# Altium schematic sheet OXCO_DaughterCard_Main.schdoc: NOT USED
size C; Date: NOT USED; ApprovedBy: NOT USED; CheckedBy: NOT USED; Author: NOT USED; CompanyName: NOT USED; DrawnBy: NOT USED; Engineer: NOT USED; Organization: NOT USED; Address1: NOT USED; Address2: NOT USED; Address3: NOT USED; Address4: NOT USED; DocumentNumber: Use Project Parameter prjSchematic_IPN; Revision: NOT USED; SheetNumber: 1; SheetTotal: 1; sch_PageDescription: DaughterCard with 4 swappable OCXO's; PageDate: NOT USED; Time: NOT USED; DocumentFullPathAndName: NOT USED; DocumentName: NOT USED; ImagePath: NOT USED; ProjectName: NOT USED; Application_BuildNumber: NOT USED
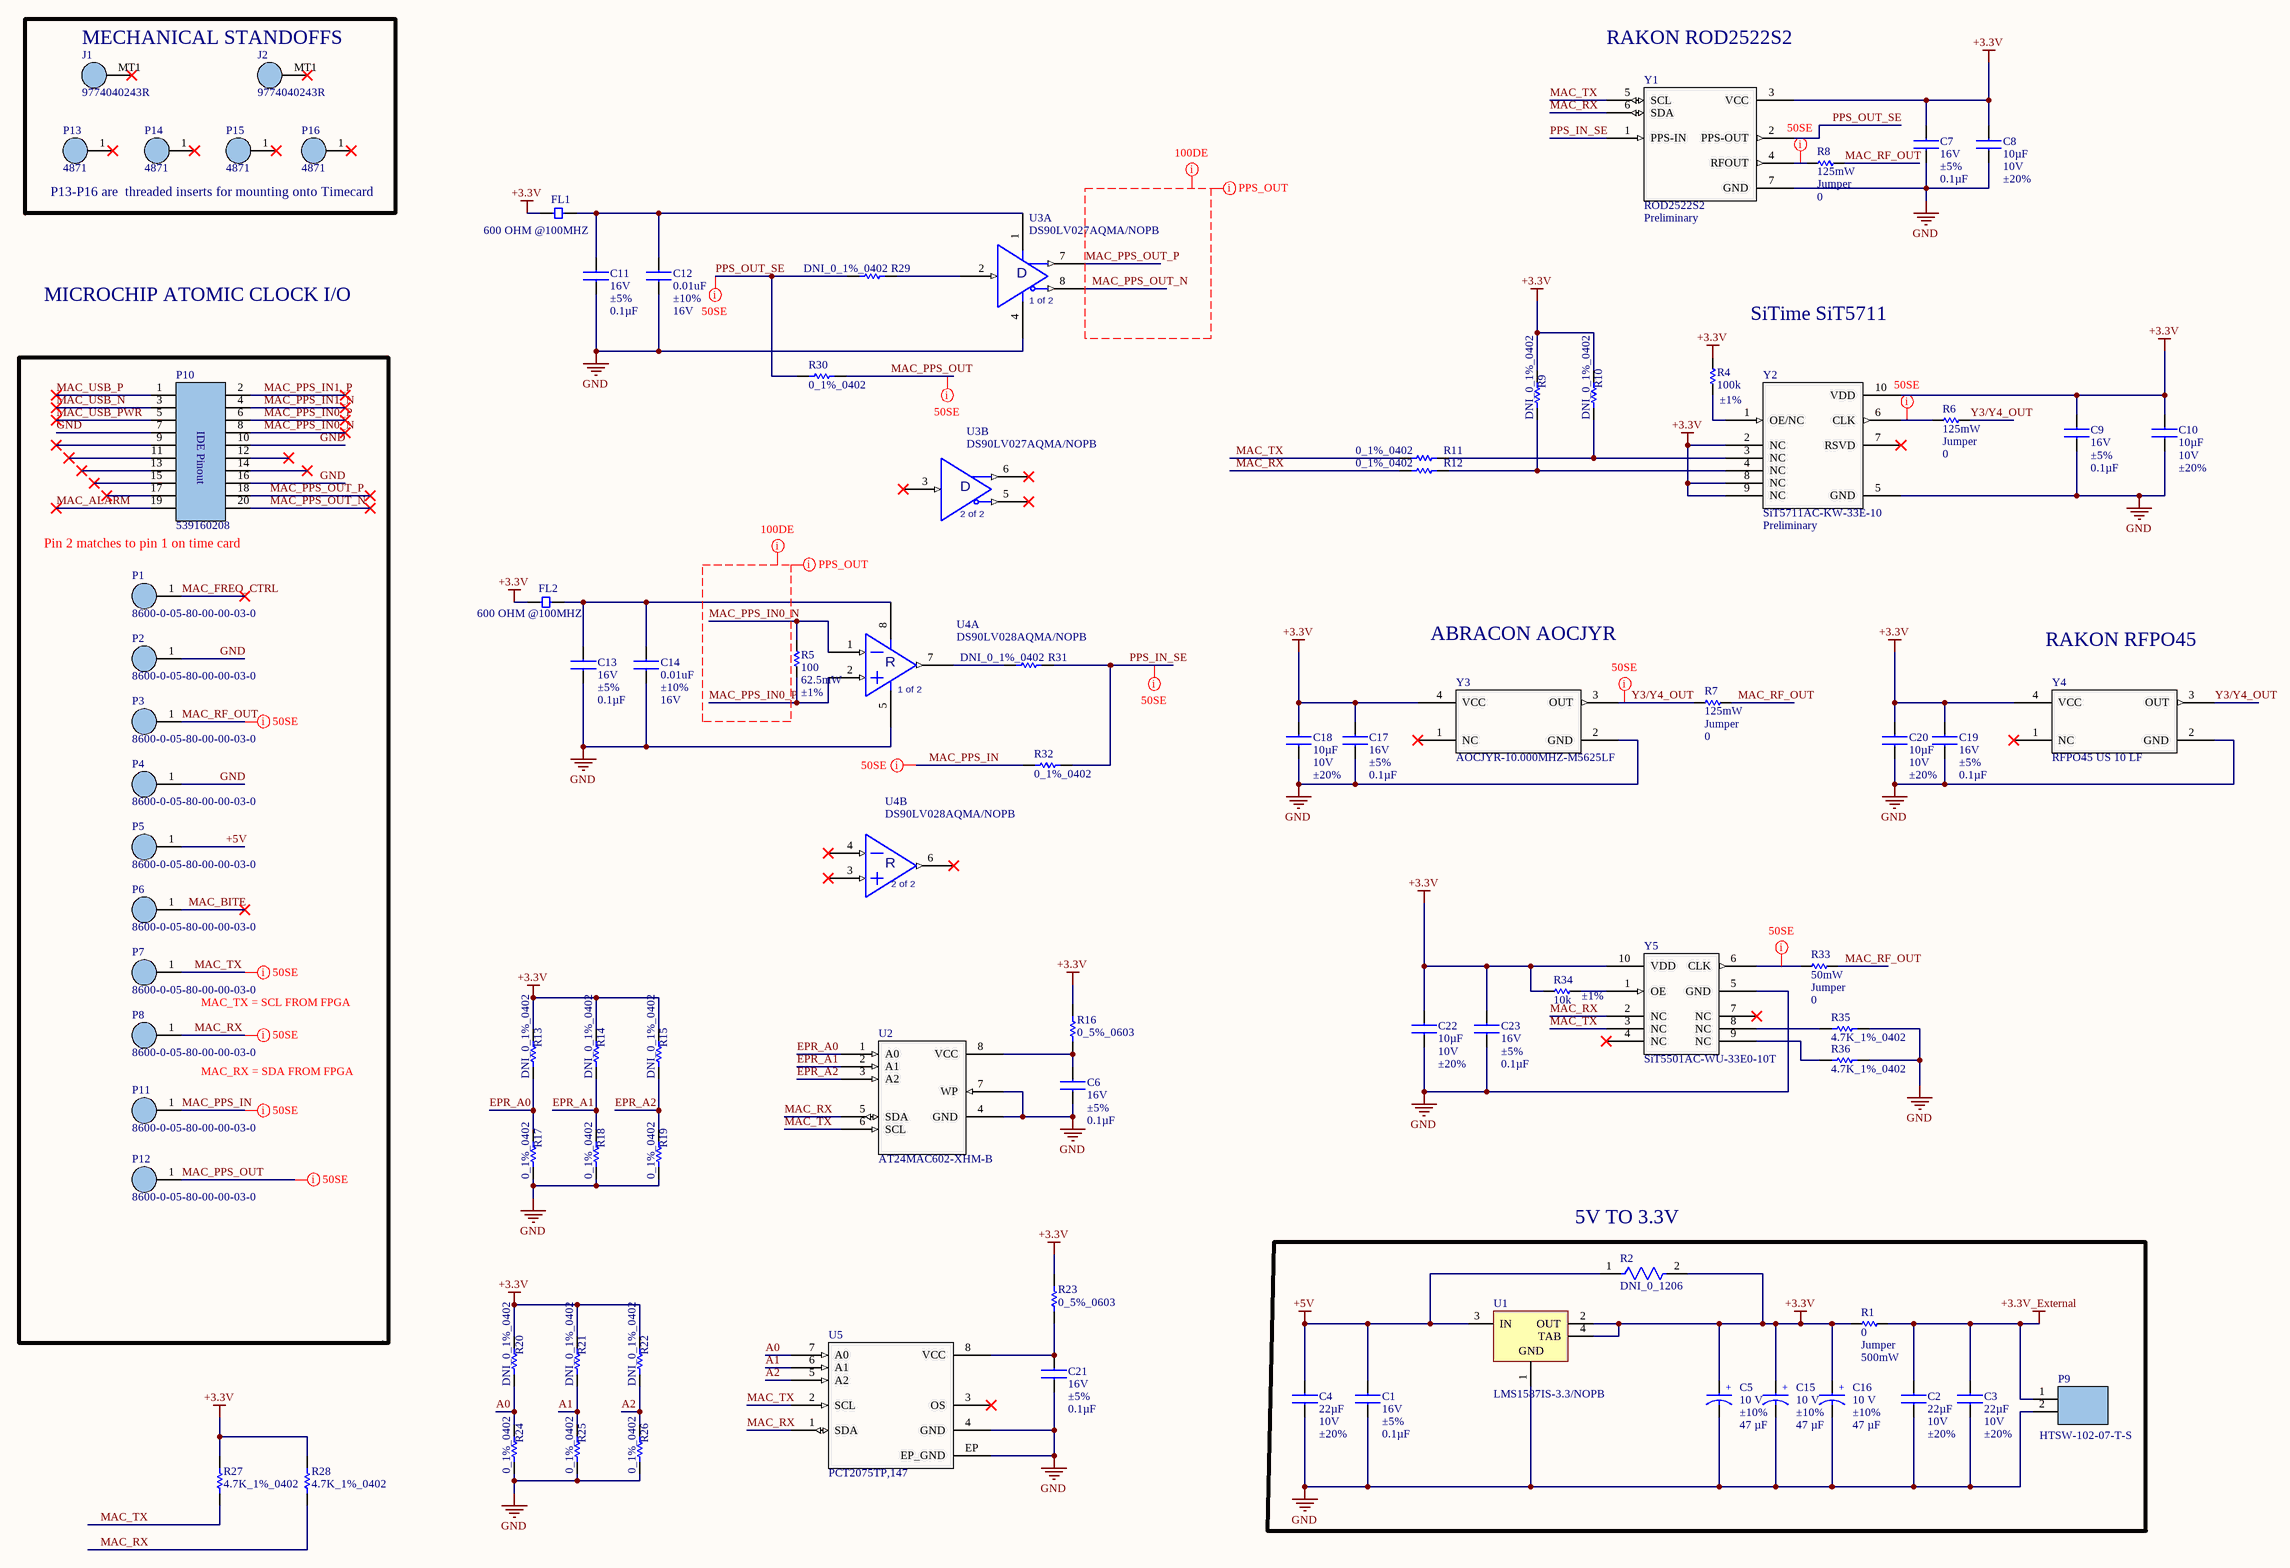
[diagram p0: OXCO_DaughterCard_Main.schdoc]

## Parts
C1  Voltage Rating: 16V  Tolerance: ±5%  Capacitance: 0.1µF  [CAPC1005X055N]  (hidden comment: Samsung Electro-Mechanics_CL05B104JO5NNNC)
C2  Capacitance: 22µF  Voltage Rating: 10V  Tolerance: ±20%  [CAPC2013X140N]  (hidden comment: Murata_GRM21BR61A226ME51L)
C3  Capacitance: 22µF  Voltage Rating: 10V  Tolerance: ±20%  [CAPC2013X140N]  (hidden comment: Murata_GRM21BR61A226ME51L)
C4  Capacitance: 22µF  Voltage Rating: 10V  Tolerance: ±20%  [CAPC2013X140N]  (hidden comment: Murata_GRM21BR61A226ME51L)
C5  Voltage Rating: 10 V  Tolerance: ±10%  Capacitance: 47 µF  [CAPMP3528X210N_T520]  (hidden comment: Kemet_T491B476K010AT)
C6  Voltage Rating: 16V  Tolerance: ±5%  Capacitance: 0.1µF  [CAPC1005X055N]  (hidden comment: Samsung Electro-Mechanics_CL05B104JO5NNNC)
C7  Voltage Rating: 16V  Tolerance: ±5%  Capacitance: 0.1µF  [CAPC1005X055N]  (hidden comment: Samsung Electro-Mechanics_CL05B104JO5NNNC)
C8  Capacitance: 10µF  Voltage Rating: 10V  Tolerance: ±20%  [CAPC1608X100N]  (hidden comment: Murata_GRM188D71A106MA73D)
C9  Voltage Rating: 16V  Tolerance: ±5%  Capacitance: 0.1µF  [CAPC1005X055N]  (hidden comment: Samsung Electro-Mechanics_CL05B104JO5NNNC)
C10  Capacitance: 10µF  Voltage Rating: 10V  Tolerance: ±20%  [CAPC1608X100N]  (hidden comment: Murata_GRM188D71A106MA73D)
C11  Voltage Rating: 16V  Tolerance: ±5%  Capacitance: 0.1µF  [CAPC1005X055N]  (hidden comment: Samsung Electro-Mechanics_CL05B104JO5NNNC)
C12  Capacitance: 0.01uF  Tolerance: ±10%  Voltage Rating: 16V  [CAPC1005X055N]  (hidden comment: Yageo_CC0402KRX7R7BB103)
C13  Voltage Rating: 16V  Tolerance: ±5%  Capacitance: 0.1µF  [CAPC1005X055N]  (hidden comment: Samsung Electro-Mechanics_CL05B104JO5NNNC)
C14  Capacitance: 0.01uF  Tolerance: ±10%  Voltage Rating: 16V  [CAPC1005X055N]  (hidden comment: Yageo_CC0402KRX7R7BB103)
C15  Voltage Rating: 10 V  Tolerance: ±10%  Capacitance: 47 µF  [CAPMP3528X210N_T520]  (hidden comment: Kemet_T491B476K010AT)
C16  Voltage Rating: 10 V  Tolerance: ±10%  Capacitance: 47 µF  [CAPMP3528X210N_T520]  (hidden comment: Kemet_T491B476K010AT)
C17  Voltage Rating: 16V  Tolerance: ±5%  Capacitance: 0.1µF  [CAPC1005X055N]  (hidden comment: Samsung Electro-Mechanics_CL05B104JO5NNNC)
C18  Capacitance: 10µF  Voltage Rating: 10V  Tolerance: ±20%  [CAPC1608X100N]  (hidden comment: Murata_GRM188D71A106MA73D)
C19  Voltage Rating: 16V  Tolerance: ±5%  Capacitance: 0.1µF  [CAPC1005X055N]  (hidden comment: Samsung Electro-Mechanics_CL05B104JO5NNNC)
C20  Capacitance: 10µF  Voltage Rating: 10V  Tolerance: ±20%  [CAPC1608X100N]  (hidden comment: Murata_GRM188D71A106MA73D)
C21  Voltage Rating: 16V  Tolerance: ±5%  Capacitance: 0.1µF  [CAPC1005X055N]  (hidden comment: Samsung Electro-Mechanics_CL05B104JO5NNNC)
C22  Capacitance: 10µF  Voltage Rating: 10V  Tolerance: ±20%  [CAPC1608X090N]  (hidden comment: Murata_GRM188R61A106ME69D)
C23  Voltage Rating: 16V  Tolerance: ±5%  Capacitance: 0.1µF  [CAPC1005X055N]  (hidden comment: Samsung Electro-Mechanics_CL05B104JO5NNNC)
FL1  Impedance @ Frequency: 600 OHM @100MHZ  [INDC1608X095N]  (hidden comment: TDK_MPZ1608S601ATA00)
FL2  Impedance @ Frequency: 600 OHM @100MHZ  [INDC1608X095N]  (hidden comment: TDK_MPZ1608S601ATA00)
J1  Manufacturer Part Number: 9774040243R  [TH000V_300DIAx400_001mt_9774040243R]  (hidden comment: Wurth_9774040243R)
J2  Manufacturer Part Number: 9774040243R  [TH000V_300DIAx400_001mt_9774040243R]  (hidden comment: Wurth_9774040243R)
P1  Manufacturer Part Number: 8600-0-05-80-00-00-03-0  [TH001V_109DIA_000mt_8600-0]  (hidden comment: Mill-Max_8600-0-05-80-00-00-03-0)
P2  Manufacturer Part Number: 8600-0-05-80-00-00-03-0  [TH001V_109DIA_000mt_8600-0]  (hidden comment: Mill-Max_8600-0-05-80-00-00-03-0)
P3  Manufacturer Part Number: 8600-0-05-80-00-00-03-0  [TH001V_109DIA_000mt_8600-0]  (hidden comment: Mill-Max_8600-0-05-80-00-00-03-0)
P4  Manufacturer Part Number: 8600-0-05-80-00-00-03-0  [TH001V_109DIA_000mt_8600-0]  (hidden comment: Mill-Max_8600-0-05-80-00-00-03-0)
P5  Manufacturer Part Number: 8600-0-05-80-00-00-03-0  [TH001V_109DIA_000mt_8600-0]  (hidden comment: Mill-Max_8600-0-05-80-00-00-03-0)
P6  Manufacturer Part Number: 8600-0-05-80-00-00-03-0  [TH001V_109DIA_000mt_8600-0]  (hidden comment: Mill-Max_8600-0-05-80-00-00-03-0)
P7  Manufacturer Part Number: 8600-0-05-80-00-00-03-0  [TH001V_109DIA_000mt_8600-0]  (hidden comment: Mill-Max_8600-0-05-80-00-00-03-0)
P8  Manufacturer Part Number: 8600-0-05-80-00-00-03-0  [TH001V_109DIA_000mt_8600-0]  (hidden comment: Mill-Max_8600-0-05-80-00-00-03-0)
P9  Manufacturer Part Number: HTSW-102-07-T-S  [TH002_254_508x254x838_000mt_HTSW]  (hidden comment: Samtec_HTSW-102-07-T-S)
P10  Manufacturer Part Number: 539160208  [SM020V_50_730x310x337_000mt_53916]  (hidden comment: Molex_539160208)
P11  Manufacturer Part Number: 8600-0-05-80-00-00-03-0  [TH001V_109DIA_000mt_8600-0]  (hidden comment: Mill-Max_8600-0-05-80-00-00-03-0)
P12  Manufacturer Part Number: 8600-0-05-80-00-00-03-0  [TH001V_109DIA_000mt_8600-0]  (hidden comment: Mill-Max_8600-0-05-80-00-00-03-0)
P13  4871  [Keystone_4871]
P14  4871  [Keystone_4871]
P15  4871  [Keystone_4871]
P16  4871  [Keystone_4871]
R1  Resistance: 0  Tolerance: Jumper  Power (Watts): 500mW  [RESC3225X070N]  (hidden comment: Stackpole Electronics, Inc._RMCF1210ZT0R00)
R2  DNI_0_1206  [FP-RC1206-MFG]  (no BOM)
R4  Resistance: 100k  Tolerance: ±1%  [RESC1005X040N]  (hidden comment: Panasonic_ERJ-2RKF1003X)
R5  Resistance: 100  Power (Watts): 62.5mW  Tolerance: ±1%  [RESC1005X040N]  (hidden comment: Yageo_RC0402FR-07100RL)
R6  Power (Watts): 125mW  Tolerance: Jumper  Resistance: 0  [RESC1005X045N]  (hidden comment: Stackpole Electronics, Inc._HCJ0402ZT0R00)
R7  Power (Watts): 125mW  Tolerance: Jumper  Resistance: 0  [RESC1005X045N]  (hidden comment: Stackpole Electronics, Inc._HCJ0402ZT0R00)
R8  Power (Watts): 125mW  Tolerance: Jumper  Resistance: 0  [RESC1005X045N]  (hidden comment: Stackpole Electronics, Inc._HCJ0402ZT0R00)
R9  DNI_0_1%_0402  [RESC1005X40X25NL05T10]  (no BOM)
R10  DNI_0_1%_0402  [RESC1005X40X25NL05T10]  (no BOM)
R11  0_1%_0402  [RESC1005X40X25NL05T10]
R12  0_1%_0402  [RESC1005X40X25NL05T10]
R13  DNI_0_1%_0402  [RESC1005X40X25NL05T10]  (no BOM)
R14  DNI_0_1%_0402  [RESC1005X40X25NL05T10]  (no BOM)
R15  DNI_0_1%_0402  [RESC1005X40X25NL05T10]  (no BOM)
R16  0_5%_0603  [RESC1608X55X25ML10T15]
R17  0_1%_0402  [RESC1005X40X25NL05T10]
R18  0_1%_0402  [RESC1005X40X25NL05T10]
R19  0_1%_0402  [RESC1005X40X25NL05T10]
R20  DNI_0_1%_0402  [RESC1005X40X25NL05T10]  (no BOM)
R21  DNI_0_1%_0402  [RESC1005X40X25NL05T10]  (no BOM)
R22  DNI_0_1%_0402  [RESC1005X40X25NL05T10]  (no BOM)
R23  0_5%_0603  [RESC1608X55X25ML10T15]
R24  0_1%_0402  [RESC1005X40X25NL05T10]
R25  0_1%_0402  [RESC1005X40X25NL05T10]
R26  0_1%_0402  [RESC1005X40X25NL05T10]
R27  4.7K_1%_0402  [RESC1005X40X25LL05T05]
R28  4.7K_1%_0402  [RESC1005X40X25LL05T05]
R29  DNI_0_1%_0402  [RESC1005X40X25NL05T10]  (no BOM)
R30  0_1%_0402  [RESC1005X40X25NL05T10]
R31  DNI_0_1%_0402  [RESC1005X40X25NL05T10]  (no BOM)
R32  0_1%_0402  [RESC1005X40X25NL05T10]
R33  Power (Watts): 50mW  Tolerance: Jumper  Resistance: 0  [RESC0603X026N]  (hidden comment: Yageo_RC0201JR-070RL)
R34  Resistance: 10k  Tolerance: ±1%  [RESC0603X026N]  (hidden comment: Yageo_RC0201FR-0710KL)
R35  4.7K_1%_0402  [RESC1005X40X25LL05T05]
R36  4.7K_1%_0402  [RESC1005X40X25LL05T05]
U1  LMS1587IS-3.3/NOPB  [KTT0003B_L]
U2  Manufacturer Part Number: AT24MAC602-XHM-B  [TSSOP65P640X120-8N]  (hidden comment: Microchip_AT24MAC602-XHM-B)
U3  Manufacturer Part Number: DS90LV027AQMA/NOPB  [SOP127P600X175_8N]  (hidden comment: TI_DS90LV027AQMA/NOPB)  (parts A,B of 2)
U4  Manufacturer Part Number: DS90LV028AQMA/NOPB  [SOP127P600X175_8N]  (hidden comment: TI_DS90LV028AQMA/NOPB)  (parts A,B of 2)
U5  Manufacturer Part Number: PCT2075TP,147  [SON50P300X200X80-HS-9N_EP160x160_IPC]  (hidden comment: NXP_PCT2075TP,147)
Y1  Manufacturer Part Number: ROD2522S2  Part Status: Preliminary  [OSC007_762_2540x2200x1230]  (hidden comment: Rakon_ROD2522S2)  (no BOM)
Y2  Manufacturer Part Number: SiT5711AC-KW-33E-10  Part Status: Preliminary  [SON150P700X619-10N_SiT5711]  (hidden comment: SiTime_SiT5711AC-KW-33E-10)  (no BOM)
Y3  Manufacturer Part Number: AOCJYR-10.000MHZ-M5625LF  [OSC004_600_970x750x410_AOCJYR]  (hidden comment: Abracon_AOCJYR-10.000MHZ-M5625LF)  (no BOM)
Y4  Manufacturer Part Number: RFPO45 US 10 LF  [OSC004_600_970x750x430_RFP045]  (hidden comment: Rakon_RFPO45 US 10 LF)  (no BOM)
Y5  Manufacturer Part Number: SiT5501AC-WU-33E0-10T  [SITIME_SPL-086-CQFN-010-C07050_REV_DRAFT]  (hidden comment: SiTime_SiT5501AC-WU-33E0-10T)  (no BOM)

## Blocks framed on the sheet
MECHANICAL STANDOFFS: J1 J2 P13-P16
Pin 2 matches to pin 1 on time card: P1-P8 P10-P12
5V TO 3.3V: C1-C5 C15 C16 P9 R1 R2 U1

## Nets
+3.3V: C5.1 C7.1 C8.1 C9.1 C10.1 C15.1 C16.1 C17.1 C18.1 C19.1 C20.1 C22.1 C23.1 FL1.1 FL2.1 R1.1 R2.2 R4.1 R9.1 R10.1 R13.1 R14.1 R15.1 R16.2 R20.1 R21.1 R22.1 R23.2 R27.2 R28.2 R34.1 U1.2(OUT) U1.4(TAB) Y1.3(VCC) Y2.2(NC) Y2.8(NC) Y2.9(NC) Y2.10(VDD) Y3.4(VCC) Y4.4(VCC) Y5.10(VDD)
+3.3V_External: C2.1 C3.1 P9.1 R1.2
+5V: C1.1 C4.1 P5.1 R2.1 U1.3(IN)
GND: C1.2 C2.2 C3.2 C4.2 C5.2 C6.2 C7.2 C8.2 C9.2 C10.2 C11.2 C12.2 C13.2 C14.2 C15.2 C16.2 C17.2 C18.2 C19.2 C20.2 C21.2 C22.2 C23.2 P2.1 P4.1 P9.2 P10.7 P10.10 P10.16 R17.2 R18.2 R19.2 R24.2 R25.2 R26.2 R35.1 R36.1 U1.1(GND) U2.4(GND) U2.7(WP) U3.4(GND) U4.5(GND) U5.4(GND) U5.EP(EP_GND) Y1.7(GND) Y2.5(GND) Y3.2(GND) Y4.2(GND) Y5.5(GND)
A0: R20.2 R24.1 U5.7(A0)
A1: R21.2 R25.1 U5.6(A1)
A2: R22.2 R26.1 U5.5(A2)
EPR_A0: R13.2 R17.1 U2.1(A0)
EPR_A1: R14.2 R18.1 U2.2(A1)
EPR_A2: R15.2 R19.1 U2.3(A2)
MAC_ALARM: P10.19
MAC_BITE: P6.1
MAC_FREQ_CTRL: P1.1
MAC_PPS_IN: P11.1 R32.1
MAC_PPS_IN0_N: P10.8 R5.1 U4.1(RIN1-)
MAC_PPS_IN0_P: P10.6 R5.2 U4.2(RIN1+)
MAC_PPS_IN1_N: P10.4
MAC_PPS_IN1_P: P10.2
MAC_PPS_OUT: P12.1 R30.2
MAC_PPS_OUT_N: P10.20 U3.8(DO-1)
MAC_PPS_OUT_P: P10.18 U3.7(DO+1)
MAC_RF_OUT: P3.1 R7.2 R8.2 R33.2
MAC_RX: P8.1 R12.1 R28.1 U2.5(SDA) U5.1(SDA) Y1.6(SDA) Y5.2(NC)
MAC_TX: P7.1 R11.1 R27.1 U2.6(SCL) U5.2(SCL) Y1.5(SCL) Y5.3(NC)
MAC_USB_N: P10.3
MAC_USB_P: P10.1
MAC_USB_PWR: P10.5
PPS_IN_SE: R31.2 R32.2 Y1.1(PPS-IN)
PPS_OUT_SE: R29.1 R30.1 Y1.2(PPS-OUT)
Y3/Y4_OUT: R6.2 R7.1 Y3.3(OUT) Y4.3(OUT)
NetC6_1: C6.1 R16.1 U2.8(VCC)
NetC11_1: C11.1 C12.1 FL1.2 U3.1(VCC)
NetC13_1: C13.1 C14.1 FL2.2 U4.8(VCC)
NetC21_1: C21.1 R23.1 U5.8(VCC)
NetR4_2: R4.2 Y2.1(OE/NC)
NetR6_1: R6.1 Y2.6(CLK)
NetR8_1: R8.1 Y1.4(RFOUT)
NetR9_2: R9.2 R12.2 Y2.4(NC)
NetR10_2: R10.2 R11.2 Y2.3(NC)
NetR29_2: R29.2 U3.2(DI1)
NetR31_1: R31.1 U4.7(ROUT1)
NetR33_1: R33.1 Y5.6(CLK)
NetR34_2: R34.2 Y5.1(OE)
NetR35_2: R35.2 Y5.8(NC)
NetR36_2: R36.2 Y5.9(NC)

Not connected (* = marked no-connect by the designer): J1 MT1*; J2 MT1*; P10 9* 11* 12* 13* 14* 15* 17*; P13 1*; P14 1*; P15 1*; P16 1*; U3 3(DI2)* 5(DO-2)* 6(DO+2)*; U4 3(RIN2+)* 4(RIN2-)* 6(ROUT2)*; U5 3(OS)*; Y2 7(RSVD)*; Y3 1(NC)*; Y4 1(NC)*; Y5 4(NC)* 7(NC)*

## Layout directives
net class 50SE: MAC_PPS_IN, MAC_PPS_OUT, MAC_RF_OUT, MAC_RX, MAC_TX, NetR6_1, NetR8_1, NetR33_1, PPS_IN_SE, PPS_OUT_SE, Y3/Y4_OUT
differential pair; differential pair class PPS_OUT: MAC_PPS_OUT_N, MAC_PPS_OUT_P
net class PPS_OUT: MAC_PPS_OUT_N, MAC_PPS_OUT_P
differential pair; differential pair class PPS_IN: MAC_PPS_IN0_N, MAC_PPS_IN0_P
net class PPS_IN: MAC_PPS_IN0_N, MAC_PPS_IN0_P

## Notes on the sheet
- RAKON ROD2522S2
- P13-P16 are  threaded inserts for mounting onto Timecard
- MICROCHIP ATOMIC CLOCK I/O
- SiTime SiT5711
- ABRACON AOCJYR
- RAKON RFPO45
- MAC_TX = SCL FROM FPGA
- MAC_RX = SDA FROM FPGA
- CONFIDENTIALITY NOTICE
- PROJECT
- FILENAME
- GENERATED DATE
- TITLE
- ENGINEER
- THIS DOCUMENT IS CONFIDENTIAL AND CONTAINS DESIGNS AND OTHER PROPRIETARY INFORMATION OF META PLATFORMS TECHNOLOGIES, LLC AND ITS AFFILIATES. THIS DOCUMENT AND THE INFORMATION IT CONTAINS MAY NOT BE DUPLICATED, DISCLOSED OR USED, IN WHOLE OR IN PART, FOR ANY PURPOSE (INCLUDING MANUFACTURE OF ANY COMPONENT) WITHOUT THE PRIOR WRITTEN CONSENT OF META PLATFORMS TECHNOLOGIES, LLC.
- DESCRIPTION
- VARIANT PCBA NUMBER
- SCHEMATIC NUMBER
- REV
- SHEET
- (in symbol CAP-CMP-00042-1) +
- (in symbol CON-CMP-00163-2) IDE Pinout
- (in symbol INT-CMP-00017-4, part A) R; 1 of 2
- (in symbol INT-CMP-00017-4, part B) R; 2 of 2
- (in symbol INT-CMP-00018-2, part A) D; 1 of 2
- (in symbol INT-CMP-00018-2, part B) D; 2 of 2

## Library data of the parts
C1 C6 C7 C9 C11 C13 C17 C19 C21 = CAP-CMP-00271-3: CAP, CER, X7R, 0.1UF, 5%, 16V, 0402, 0.55MM T; Polarization: Non-polar; Composition: Ceramic; RoHS: Yes; Series: CL; Manufacturer: Samsung Electro-Mechanics; Mounting Type: Surface Mount, MLCC; Max Operating Temperature: 125°C; Height: 0.022" (0.55mm); Applications: General Purpose; Size / Dimension: 0.039" L x 0.020" W (1.00mm x 0.50mm); Supplier Part Number 1: 1276-1505-1-ND; Manufacturer Part Number: CL05B104JO5NNNC; Datasheet URL: https://www.digikey.com/en/products/detail/samsung-electro-mechanics/CL05B104JO5NNNC/3887163?s=N4IgTCBcDaIMIBkAMBWAQgRiQFgFIHkUA5EuEAXQF8g; Temperature Coefficient: X7R; Min Operating Temperature: -55°C; Category: Ceramic Capacitors; Case/Package: 0402 (1005 Metric); Supplier 1: Digikey
C2-C4 = CAP-CMP-00519-3: CAP, CER, X5R, 22UF, 20%, 10V, 0805, 1.40MM T; Manufacturer: Murata; Polarization: Non-polar; Category: Ceramic Capacitors; Mounting Type: Surface Mount, MLCC; Case/Package: 0805 (2013 Metric); RoHS: Yes; Height: 0.055" (1.40mm); Supplier 1: Digikey; Supplier Part Number 1: 490-10511-1-ND; Size / Dimension: 0.079" L x 0.049" W (2.00mm x 1.25mm); Min Operating Temperature: -55°C; Datasheet URL: https://www.digikey.com/en/products/detail/murata-electronics/GRM21BR61A226ME51L/5027595?s=N4IgTCBcDaIOICUCyYCMAhBA2VBBMYWSAogKyoAyIAugL5A; Manufacturer Part Number: GRM21BR61A226ME51L; Series: GRM21BR61A; Applications: General Purpose; Composition: Ceramic; Temperature Coefficient: X5R; Max Operating Temperature: 85°C
C5 C15 C16 = CAP-CMP-00042-1: CAP TANT 47UF 10% 10V 1411; Manufacturer: Kemet; Type: Molded; Polarization: Polar; ESR (Equivalent Series Resistance): 1Ohm; Case/Package: 1411 (3528 Metric); Height: 0.083" (2.10mm); Features: General Purpose; Manufacturer Part Number: T491B476K010AT; RoHS: Yes; Category: Tantalum Capacitors; Size / Dimension: 0.138" L x 0.110" W (3.50mm x 2.80mm); Datasheet URL: https://www.digikey.com/en/products/detail/kemet/T491B476K010AT/3724805; Series: T491; Min Operating Temperature: -55°C; Supplier Part Number 1: 399-9728-1-ND; Composition: Tantalum; Max Operating Temperature: 125°C; Supplier 1: Digikey; Mounting Type: Surface Mount
C8 C10 C18 C20 = CAP-CMP-00449-3: CAP, CER, X7T, 10UF, 20%, 10V, 0603, 1.00MM T; Manufacturer: Murata; Polarization: Non-polar; Manufacturer Part Number: GRM188D71A106MA73D; Max Operating Temperature: 125°C; Temperature Coefficient: X7T; Series: GRM188D71A; Size / Dimension: 0.063" L x 0.031" W (1.60mm x 0.80mm); Min Operating Temperature: -55°C; Supplier Part Number 1: 490-7200-1-ND; Composition: Ceramic; Applications: General Purpose; Height: 0.039" (1.00mm); RoHS: Yes; Mounting Type: Surface Mount, MLCC; Case/Package: 0603 (1608 Metric); Supplier 1: Digikey; Datasheet URL: https://www.digikey.com/en/products/detail/murata-electronics/GRM188D71A106MA73D/3900467?s=N4IgTCBcDaIOICUCyBGAHGgIgdhQQRQAYA2JPbAZkxAF0BfIA; Category: Ceramic Capacitors
C12 C14 = CAP-CMP-00257-3: CAP, CER, X7R, 0.01UF, 10%, 16V, 0402, 0.55MM T; Manufacturer: Yageo; Polarization: Non-polar; RoHS: Yes; Case/Package: 0402 (1005 Metric); Composition: Ceramic; Min Operating Temperature: -55°C; Datasheet URL: https://www.digikey.com/en/products/detail/yageo/CC0402KRX7R7BB103/302776?s=N4IgTCBcDaIMJwAwBZFgNICUAaB2TuAQoQIyIDMIAugL5A; Applications: General Purpose; Series: CC; Height: 0.022" (0.55mm); Max Operating Temperature: 125°C; Temperature Coefficient: X7R; Supplier 1: Digikey; Manufacturer Part Number: CC0402KRX7R7BB103; Mounting Type: Surface Mount, MLCC; Category: Ceramic Capacitors; Size / Dimension: 0.039" L x 0.020" W (1.00mm x 0.50mm); Supplier Part Number 1: 311-1042-1-ND
C22 = CMP-CAP-00380-1: CAP, CER, X5R, 10UF, 20%, 10V, 0603, 0.80MM T; Manufacturer: Murata; Polarization: Non-polar; Manufacturer Part Number: GRM188R61A106ME69D; Max Operating Temperature: 85°C; Temperature Coefficient: X5R; Series: GRM188R61A; Size / Dimension: 0.063" L x 0.031" W (1.60mm x 0.80mm); Min Operating Temperature: -55°C; Supplier Part Number 1: 490-10475-1-ND; Composition: Ceramic; Applications: General Purpose; Height: 0.035" (0.90mm); RoHS: Yes; Mounting Type: Surface Mount, MLCC; Case/Package: 0603 (1608 Metric); Supplier 1: Digikey; Datasheet URL: https://www.digikey.com/en/products/detail/murata-electronics/GRM188R61A106ME69D/5027560?s=N4IgTCBcDaIOICUCyBGAHGhA2FBBFADFkgKJYCcAIiALoC%2BQA; Category: Ceramic Capacitors
C23 = CMP-CAP-00082-2: CAP, CER, X7R, 0.1UF, 5%, 16V, 0402, 0.55MM T; Polarization: Non-polar; Composition: Ceramic; RoHS: Yes; Series: CL; Manufacturer: Samsung Electro-Mechanics; Mounting Type: Surface Mount, MLCC; Max Operating Temperature: 125°C; Height: 0.022" (0.55mm); Applications: General Purpose; Size / Dimension: 0.039" L x 0.020" W (1.00mm x 0.50mm); Supplier Part Number 1: 1276-1505-1-ND; Manufacturer Part Number: CL05B104JO5NNNC; Datasheet URL: https://www.digikey.com/en/products/detail/samsung-electro-mechanics/CL05B104JO5NNNC/3887163?s=N4IgTCBcDaIMIBkAMBWAQgRiQFgFIHkUA5EuEAXQF8g; Temperature Coefficient: X7R; Min Operating Temperature: -55°C; Category: Ceramic Capacitors; Case/Package: 0402 (1005 Metric); Supplier 1: Digikey
FL1 FL2 = FER-CMP-00057-5: FERRITE BEAD, 600 OHM @100MHZ, 25%, 1A, 0.150 OHM DCR, 0603, 0.95MM T; Manufacturer: TDK; Tolerance: 0.25%; Filter Type: Power Line; DC Resistance (Max): 0.15; Polarization: Non-polar; Lines: 1; Manufacturer Part Number: MPZ1608S601ATA00; Supplier 1: Digi-Key; Height: 0.037" (0.95mm); Datasheet URL: https://product.tdk.com/en/system/files?file=dam/doc/product/emc/emc/beads/catalog/beads_commercial_power_mpz1608_en.pdf; Category: Ferrite Beads and Chips; Current Rating: 1A; Max Operating Temperature: 125°C; Series: MPZ; Supplier Part Number 1: 445-2205-1-ND; Min Operating Temperature: -55°C; RoHS: Yes; Size / Dimension: 0.063" L x 0.032" W (1.60mm x 0.80mm); Case/Package: 0603 (1608 Metric)
J1 J2 = CON-CMP-00164-1: STANDOFF, ROUND, M2X0.4 STEEL 4MM, 9774040243R; Manufacturer: Wurth Elektronik; System: connector; Screw Thread: M2x0.4; Min Operating Temperature: -55°C; Series: WA-SMSI; Max Operating Temperature: 150°C; Type: Round Standoff; Mounting Type: Through Hole, Vertical; Supplier 1: Digikey; Supplier Part Number 1: 732-7090-1-ND; Height: 0.157" (4.00mm); RoHS: Yes; Contact Material: Steel; Category: Board Spacers, Standoffs; Datasheet URL: https://www.digikey.com/en/products/detail/w%C3%BCrth-elektronik/9774040243R/5320633?s=N4IgTCBcDaIJwHYEBYAMazIMwCUQF0BfIA
P1-P8 P11 P12 = CON-CMP-00162-1: CONN, PC PIN, PRESS-FIT, 10.16MM LENGTH, TIN, TH; Manufacturer: Mill-Max Manufacturing Corp.; Flange Diameter: 0.072" (1.83mm); System: connector; Pin Size - Above Flange: 0.040" (1.02mm) Dia; Mounting Hole Diameter: 0.043" (1.09mm); Rows: 1; Insulation: Non-Insulated; Pin Size - Below Flange: 0.035" (0.89mm) Square; Contact Material: Brass Alloy; Terminal Type: PC Pin; Length - Below Flange: 0.060" (1.52mm); Supplier Part Number 1: 8600-0-05-80-00-00-03-0-ND; Length - Overall: 0.460" (11.68mm); Min Operating Temperature: -55°C; Series: 8600; Max Operating Temperature: 125°C; Length - Above Flange: 0.364" (9.25mm); Contact Finish: Tin; Termination: Press-Fit, Square; Mounting Type: Through Hole, Vertical; RoHS: Yes; Category: Terminals - PC Pin, Single Post Connectors; Terminal Style: Single End; Supplier 1: Digikey; Datasheet URL: https://www.digikey.com/en/products/detail/mill-max-manufacturing-corp/8600-0-05-80-00-00-03-0/7775333?s=N4IgTCBcDaIBwDYAMSC0akFZVw39AzOiALoC%2BQA; Signal Pins: 1
P9 = CON-CMP-00061-3: CONN, PIN, HEADER, 2POS, 2.54MM PITCH, 8.38MM H, VERT, TIN, TH; Manufacturer: Samtec Inc.; System: connector; Shrouded: Unshrouded; Current Rating: Varies by Wire Gauge; Pitch: 0.100" (2.54mm); Style: Board to Board or Cable; Signal Pins: 2; Rows: 1; Contact Finish: Tin; Max Operating Temperature: 105°C; Height: 8.38mm; Fastening Type: Push-Pull; Series: HTSW-102; Termination: Solder; Supplier 1: Digikey; RoHS: Yes; Contact Material: Phosphor Bronze; Supplier Part Number 1: SAM8921-ND; Category: Rectangular Connectors - Headers, Male Pins; Mounting Type: Through Hole, Vertical; Min Operating Temperature: -55°C; Contact Type: Male Pin; Color: Natural; Datasheet URL: https://www.digikey.com/en/products/detail/samtec-inc/HTSW-102-07-T-S/2664207?s=N4IgTCBcDaIBIBUDKB1AtARgAxjVg7GgmkiALoC%2BQA; Connector Type: Header
P10 = CON-CMP-00163-2: CONN, B2B/FPC, HEADER, 20-POS, 0.5MM PITCH, 4.0MM H, VERT, GOLD, SMT; Manufacturer: Molex; Pitch: 0.50mm; Mated Stacking Heights: 4mm; Signal Pins: 20; Style: Board to Board, Signal; System: connector; Connector Type: Plug, Outer Shroud Contacts; Voltage Rating: 50V; Rows: 2; Current Rating: 0.5A; Supplier 1: Digikey; Min Operating Temperature: -40°C; RoHS: Yes; Series: SlimStack 53916; Contact Finish: Gold; Mounting Type: Surface Mount, Vertical; Category: Rectangular Connectors - Arrays, Edge Type, Mezzanine (Board to Board); Supplier Part Number 1: WM9212CT-ND; Max Operating Temperature: 105°C; Datasheet URL: https://www.digikey.com/en/products/detail/molex/0539160208/1059866; Height: 0.133" (3.37mm); Number of Positions/Contacts: 20
P13-P16 = Keystone_4871: Round Standoff Threaded #2-56 Steel 0.063" (1.60mm) 1/16"; System: connector; Manufacturer: Keystone; Mounting Type: Through Hole, Vertical; RoHS: Yes; Manufacturer Part Number: 4871
R1 = RES-CMP-00829-3: RES, 0.0 OHM, 3A, 1/2W, 1210; Supplier Part Number 1: RMCF1210ZT0R00CT-ND; Ratings: AEC-Q200; Max Operating Temperature: 155°C; Supplier 1: Digikey; Category: Chip Resistor - Surface Mount; Datasheet URL: https://www.digikey.com/en/products/detail/stackpole-electronics-inc/RMCF1210ZT0R00/1715043?s=N4IgTCBcDaIEoFkDCAxAjGNAGAWgFSziyxAF0BfIA; Case/Package: 1210 (3225 Metric); Manufacturer Part Number: RMCF1210ZT0R00; Manufacturer: Stackpole Electronics, Inc.; Features: Automotive AEC-Q200; Series: RMCF; RoHS: Yes; Size / Dimension: 0.126" L x 0.098" W (3.20mm x 2.50mm); Height: 0.028" (0.70mm); Min Operating Temperature: -55°C; Composition: Thick Film
R2 = CMP-2100-03681-2: RES SMD 0 OHM JUMPER 1/4W 1206; Manufacturer Part Number: RC1206JR-070RL; Manufacturer: YAGEO; Voltage Rating: 200V; Temperature Coefficient: 300ppm/°C; Power Rating: 0.25W; Value: 0Ω; Tolerance: 5%; Temperature Range Low: -55°C; Category: Res; Automotive: No; Ipc Land Pattern Name: RESC310160X55; Device Class L1: Passive Components; Temperature: -55°C to +155°C; ComponentLink2URL: https://www.yageo.com/upload/media/product/productsearch/datasheet/rchip/PYu-RC_Group_51_RoHS_L_10.pdf; Lead Free: Yes; Height: 0.65mm; Footprint Url: https://www.yageo.com/upload/website/yageo_PYu-R_Mount_10_19050818_343.pdf; Package: RC1206; Digikey Description: RES SMD 0 OHM JUMPER 1/4W 1206; Temperature Range High: +155°C; Device Class L3: Chip SMD Resistors; Device Class L2: Resistors; Octopart: https://octopart.com/rc1206jr-070rl-yageo-40025601; Resistance: 0Ω; Series: RC; ComponentLink2Description: Datasheet; Composition: Thick Film; RoHS: TRUE; Mouser Description: Resistor: thick film; SMD; 1206; 0O; 0.25W; ±5%; -55÷155°C
R4 = RES-CMP-00289-3: RES, 100K OHM, 1%, 1/10W, 100PPM/C, 0402; Temperature Coefficient: ±100ppm/°C; Power (Watts): 100mW; Category: Chip Resistor - Surface Mount; Manufacturer Part Number: ERJ-2RKF1003X; Supplier 1: Digikey; Manufacturer: Panasonic; Datasheet URL: https://www.digikey.com/en/products/detail/panasonic-electronic-components/ERJ-2RKF1003X/192081?s=N4IgTCBcDaIKICUBSBaMCDSAxAjABjwGYANEAXQF8g; Ratings: AEC-Q200; RoHS: Yes; Supplier Part Number 1: P100KLCT-ND; Max Operating Temperature: 155°C; Size / Dimension: 0.039" L x 0.020" W (1.00mm x 0.50mm); Case/Package: 0402 (1005 Metric); Height: 0.016" (0.40mm); Series: ERJ-2RK; Features: Automotive AEC-Q200; Composition: Thick Film; Min Operating Temperature: -55°C
R5 = RES-CMP-00538-3: RES SMD 100 OHM 1% 1/16W 0402; Manufacturer: Yageo; Temperature Coefficient: ±100ppm/°C; Manufacturer Part Number: RC0402FR-07100RL; Supplier 1: Digi-Key; RoHS: Yes; Height: 0.016" (0.40mm); Size / Dimension: 0.039" L x 0.020" W (1.00mm x 0.50mm); Composition: Thick Film; Series: RC_L; Category: Chip Resistor - Surface Mount; Min Operating Temperature: -55°C; Datasheet URL: https://www.yageo.com/upload/media/product/productsearch/datasheet/rchip/PYu-RC_Group_51_RoHS_L_11.pdf; Case/Package: 0402 (1005 Metric); Max Operating Temperature: 155°C; Supplier Part Number 1: 311-100LRCT-ND
R6-R8 = RES-CMP-00382-3: RES, 0.0 OHM, 1/8W, 6.5A, 0402; Datasheet URL: https://www.digikey.com/en/products/detail/stackpole-electronics-inc/HCJ0402ZT0R00/4357659?s=N4IgTCBcDaIBIGEBSAGALCsAtAKigSiiiALoC%2BQA; Manufacturer Part Number: HCJ0402ZT0R00; Height: 0.018" (0.45mm); Max Operating Temperature: 155°C; RoHS: Yes; Manufacturer: Stackpole Electronics, Inc.; Features: Automotive AEC-Q200; Composition: Metal Foil; Case/Package: 0402 (1005 Metric); Supplier Part Number 1: HCJ0402ZT0R00CT-ND; Supplier 1: Digikey; Series: HCJ; Category: Chip Resistor - Surface Mount; Size / Dimension: 0.039" L x 0.020" W (1.00mm x 0.50mm); Min Operating Temperature: -55°C
R9-R15 R17-R22 R24-R26 R29-R32 = CMP-1011-00001-2: Manufacturer: Yageo / Phycomp; Part Number: RC0402JR-070RL
R16 R23 = CMP-2100-03667-1: Chip Resistor, 0 Ohm, +/- 5%, 0.1 W, -55 to 155 degC, 0603 (1608 Metric), RoHS, Tape and Reel; Manufacturer: Yageo; Temperature Coefficient: 200ppm/degreesC; Voltage Rating: 50V; Power Rating: 100mW; Resistance: 0mOhm; Width: 0.8mm; Max Operating Temperature: 155degC; Tolerance: 5%; Package Reference: 0603; Height: 0.45mm; Depth: 0.8mm; Package Description: 2-Pin Surface Mount Device, Body 1.6 x 0.8 mm; Termination: SMD/SMT; Package Quantity: 5000; Case/Package: 0603; Case Code (Imperial): 0603; Radiation Hardening: No; Number of Pins: 2; Length: 1.6mm; Lead Free: LeadFree; Voltage Rating (DC): 50V; Military Standard: Not; Datasheet URL: http://www.yageo.com/NewPortal/yageodocoutput?fileName=/pdf/R-Chip/PYu-RC_Group_51_RoHS_L_5.pdf; Manufacturer URL: http://www.yageo.com/; Packaging: TapeandReel; Case Code (Metric): 1608; Min Operating Temperature: -55degC; Composition: ThickFilm; RoHSCompliant: true; Contact Plating: Tin; Datasheet Version: Rev. 5, 10/2016; REACH SVHC: NoSVHC
R27 R28 R35 R36 = CMP-2002-01154-4: Chip Resistor, 4.7 KOhm, +/- 1%, 0.1 W, -55 to 155 degC, 0402 (1005 Metric), RoHS, Tape and Reel; PartNumber: ERJ-2RKF4701X; Voltage Rating: 50 V; Case\/Package: 0402; Power Rating: 100 mW; Height: 0.35 mm; Mounting Technology: Surface Mount; REACH SVHC: Yes; Resistance: 4.7 KOhm; Max Operating Temperature: 155 degC; ComponentLink1Description: Manufacturer URL; ComponentLink2Description: Datasheet; Pins: 2; PackageReference: 0402; Tolerance: 1%; Case Code (Imperial): 0402; Length: 1 mm; PackageDescription: 2-Pin Surface Mount Device, Body 1 x 0.5 mm; RoHSCompliant: true; Package Quantity: 1; Radiation Hardening: No; DatasheetVersion: 04/2015; Width: 0.5 mm; Case Code (Metric): 1005; Mount: Surface Mount; ComponentLink1URL: http://www.panasonic.com/; Min Operating Temperature: -55 degC; Packaging: Cut Tape; ComponentLink2URL: http://industrial.panasonic.com/cdbs/www-data/pdf/RDA0000/AOA0000C86.pdf
R33 = CMP-RES-00843-1: RES, 0.0 OHM, 0.5A, 1/20W, 0201; Manufacturer: Yageo; Datasheet URL: https://www.yageo.com/upload/media/product/productsearch/datasheet/rchip/PYu-RC_Group_51_RoHS_L_11.pdf; Manufacturer Part Number: RC0201JR-070RL; Height: 0.010" (0.26mm); Composition: Thick Film; Case/Package: 0201 (0603 Metric); Supplier Part Number 1: 311-0.0NCT-ND; Supplier 1: Digi-Key; Series: RC; Category: Chip Resistor - Surface Mount; Size / Dimension: 0.024" L x 0.012" W (0.60mm x 0.30mm)
R34 = CMP-RES-00602-1: RES, 10K OHM, 1%, 1/20W, 200PPM/C, 0201; Manufacturer: Yageo; Temperature Coefficient: ±200ppm/°C; Power (Watts): 50mW; Series: RC_L; Case/Package: 0201 (0603 Metric); Supplier Part Number 1: *; Manufacturer Part Number: RC0201FR-0710KL; Size / Dimension: 0.024" L x 0.012" W (0.60mm x 0.30mm); Category: Chip Resistor - Surface Mount; RoHS: Yes; Datasheet URL: *; Supplier 1: *; Height: *; Composition: *
U1 = CMP-0062-00189-5: 3A Low Dropout Fast Response Regulators, 3-pin TO-263, Pb-Free; Manufacturer: Texas Instruments; CompType: LDO IC; High-Reliability: Y; PowerWise: N; PackageTopMarking: NSUZXYTTE#*LMS1587*IS-3.3; PackageReference: KTT0003B; PartNumber: LMS1587IS-3.3/NOPB; ComponentLink1Description: Datasheet URL; PackageDescription: TO-263, Molded, .400 x .390 x .180in, 3 Lead, .1in Pitch, Surface Mount; PinCount: 3; ComponentLink1URL: http://www.ti.com/general/docs/lit/getliterature.tsp?genericPartNumber=LMS1587&fileType=pdf; RoHS: Y; Code_JEDEC: MO-169-AA
U2 = MEM-CMP-00010-1: IC, EEPROM, AT24MAC602, 2K-BIT (256 X 8), 1MHZ, I2C, 1.7V - 5.5V, TSSOP-8; Manufacturer: Microchip Technology; Access Time: 550 ns; Memory Type: Non-Volatile; Memory Interface: I²C; Voltage - Supply: 1.7V ~ 5.5V; Memory Size: 2Kb (256 x 8); Case/Package: 8-TSSOP (0.173", 4.40mm Width); Category: Memory; Datasheet URL: https://www.digikey.com/en/products/detail/microchip-technology/AT24MAC602-XHM-B/5057027; Memory Format: EEPROM; Supplier 1: Digikey; RoHS: Yes; Mounting Type: Surface Mount; Supplier Part Number 1: AT24MAC602-XHM-B-ND; Clock Frequency: 1 MHz; Max Operating Temperature: 85°C; Technology: EEPROM; Min Operating Temperature: -40°C
U3 = INT-CMP-00018-2: IC, DRIVER, DS90LV027AQ, DUAL, DIFF, LVDS, 600MBPS, SOIC-8; Manufacturer: Texas Instruments; Number of Drivers/Receivers: 2/0; Voltage - Supply: 3V ~ 3.6V; Series: Automotive, AEC-Q100; Mounting Type: Surface Mount; Min Operating Temperature: -40°C; Max Operating Temperature: 85°C; Supplier Part Number 1: DS90LV027AQMA/NOPB-ND; Case/Package: 8-SOIC (0.154", 3.90mm Width); Category: Drivers, Receivers, Transceivers; Supplier 1: Digikey; Datasheet URL: https://www.digikey.com/en/products/detail/texas-instruments/DS90LV027AQMA-NOPB/1888061; Protocol: LVDS; RoHS: Yes; Data Rate: 600Mbps; Type: Driver
U4 = INT-CMP-00017-4: IC, RVCR, DS90LV028AQ-Q1, DUAL, DIFF, LVDS, 400MBPS, SOIC-8; Manufacturer: Texas Instruments; Number of Drivers/Receivers: 0/2; Voltage - Supply: 3V ~ 3.6V; RoHS: Yes; Category: Drivers, Receivers, Transceivers; Supplier Part Number 1: DS90LV028AQMA/NOPB-ND; Data Rate: 400Mbps; Supplier 1: Digikey; Protocol: LVDS; Type: Receiver; Min Operating Temperature: -40°C; Datasheet URL: https://www.digikey.com/en/products/detail/texas-instruments/DS90LV028AQMA-NOPB/13431640?s=N4IgTCBcDaICIGUCcAGAMgNRWAHAQQEUBZPAegDkB5ABQCEQBdAXyA; Mounting Type: Surface Mount; Max Operating Temperature: 125°C; Case/Package: 8-SOIC (0.154", 3.90mm Width); Series: Automotive, AEC-Q100
U5 = SNS-CMP-00004-1: SENSOR DIGITAL -55C-125C 8HWSON; Manufacturer: NXP USA Inc.; Resolution (Bits): 11 b; Voltage - Supply: 2.7V ~ 5.5V; Sensing Temperature - Local: -55°C ~ 125°C; Sensor Type: Digital, Local; Output Type: I²C/SMBus; Mounting Type: Surface Mount; Series: PCT2075; Max Operating Temperature: 125°C; Category: Temperature Sensors - Analog and Digital Output; Features: Output Switch, Programmable Limit; Supplier 1: Digikey; Case/Package: 8-WFDFN Exposed Pad; RoHS: Yes; Datasheet URL: https://www.digikey.com/en/products/detail/nxp-usa-inc/PCT2075TP-147/3991863?s=N4IgTCBcDaIAoGEAqYAMB2ArEuAaAjACzogC6AvkA; Min Operating Temperature: -55°C; Supplier Part Number 1: 568-10220-1-ND
Y1 = COR-CMP-00010-2: OSC, OCXO, 10MHZ - 20MHZ, 0.5PPB STAB, 3.3V, 22.0X25.4X12.3MM, SMT; Manufacturer: Rakon; Frequency Stability: ±0.5ppm; Frequency: 10 MHz; Mounting Type: Surface Mount; RoHS: Yes; Max Operating Temperature: 85°C; Voltage - Supply: 3.3V; Type: OCXO; Size / Dimension: 22.00mm x 25.00mm; Height: 12.3mm; Min Operating Temperature: -40°C; Category: Oscillators; Case/Package: 7-SMD, No Lead
Y2 = COR-CMP-00012-1: OSC, OCXO, 10.000MHZ, 5PPM STAB, LVCMOS/CLIPPED SINE, 3.3V, DFN-10; Manufacturer: SiTime; Frequency Stability: +5ppm; Frequency: 10 MHz; Output: LVCMOS; Category: Oscillators; Max Operating Temperature: 70°C; Size / Dimension: 7.0mm x 9.0mm; RoHS: Yes; Voltage - Supply: 3.3V; Case/Package: 10-DFN; Height: 6.19mm; Mounting Type: Surface Mount; Series: SiT5711; Min Operating Temperature: -20°C
Y3 = COR-CMP-00013-2: OSC, OCXO, 10.000MHZ, 25PPB STAB, LVCMOS, 3.3V, 9.7X7.5X4.3MM, SMT; Manufacturer: Abracon LLC; Frequency: 10 MHz; Load Capacitance: 15pF; Case/Package: 4-SMD, No Lead; Max Operating Temperature: 85°C; Frequency Stability: ±25ppb; Series: AOCJYR; Mounting Type: Surface Mount; Voltage - Supply: 3.3V; Category: Crystals; Min Operating Temperature: -40°C; Output: LVCMOS; Supplier Part Number 1: 535-12623-ND; Supplier 1: Digikey; Type: OCXO; RoHS: Yes; Datasheet URL: https://www.digikey.com/en/products/detail/abracon-llc/AOCJYR-10-000MHZ-M5625LF/4989029; Height: 0.169" (4.30mm); Size / Dimension: 0.382" L x 0.295" W (9.70mm x 7.50mm)
Y4 = COR-CMP-00014-2: OSC, OCXO, RFPO45, 10 - 26MHZ, 10PPB STAB, HCMOS, 3.3V, 9.7X7.5X4.3MM, SMT; Manufacturer: Rakon; Frequency Stability: ±10ppm; Frequency: 10 MHz; Size / Dimension: 9x7x4mm; Height: 4.12mm; Category: Oscillators; Max Operating Temperature: 70°C; Voltage - Supply: 3.3V; RoHS: Yes; Min Operating Temperature: -20°C; Type: OCXO; Case/Package: 4-SMD; Mounting Type: Surface Mount
Y5 = CMP-OSC-00029-2: OSC, MEMS, STRATUM 3E, 10.000MHZ, 10PPB STAB, LVCMOS, 3.3V, O/P EN, 7.0X5.0X2.2MM, CQFN-10; Manufacturer: SiTime; Frequency: 10 MHz; Voltage - Supply: 3.3 V; Type: OCXO; Category: Oscillators; Max Operating Temperature: 70°C; Min Operating Temperature: -20°C; Height: 2.20mm (max); Case/Package: 10 Lead QFN; Output: LVCMOS; Mounting Type: Surface Mount; Frequency Stability: ±10 ppb; RoHS: Yes